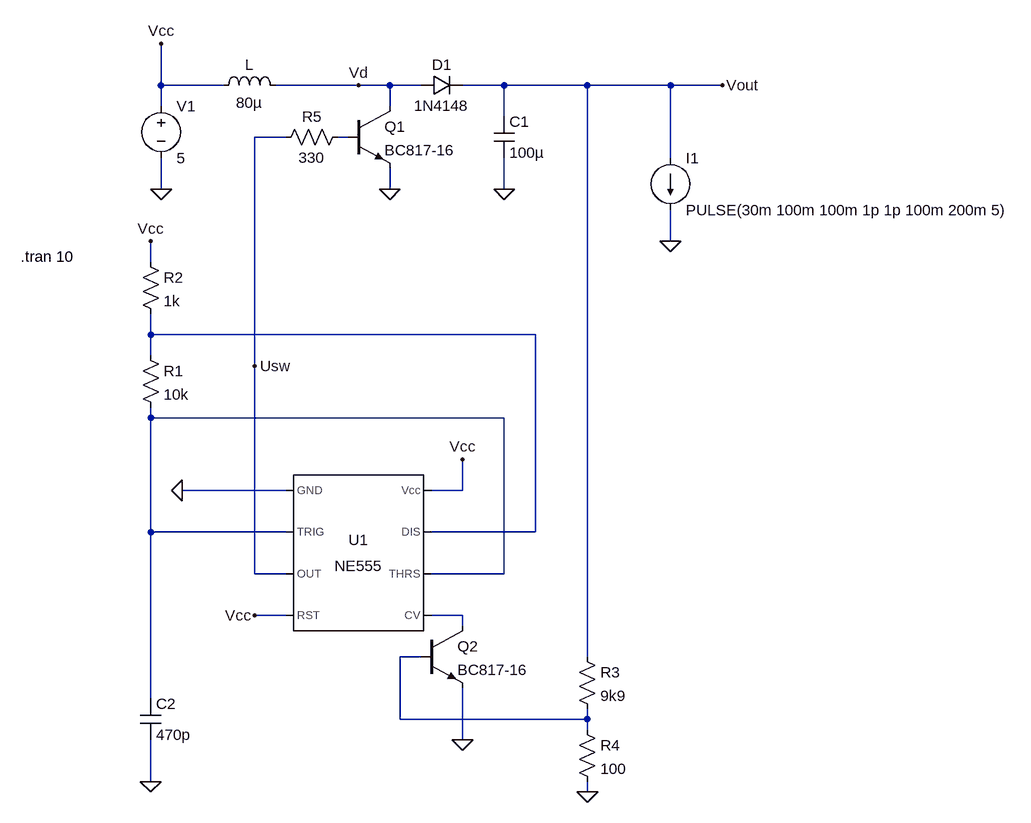
[diagram p0: schematic 555_boost2.asc]
555_boost2.asc, the LTspice schematic file:
Version 4
SHEET 1 1404 980
WIRE 64 -128 64 -192
WIRE 160 -128 64 -128
WIRE 368 -128 240 -128
WIRE 416 -128 368 -128
WIRE 464 -128 416 -128
WIRE 592 -128 528 -128
WIRE 720 -128 592 -128
WIRE 848 -128 720 -128
WIRE 928 -128 848 -128
WIRE 64 -96 64 -128
WIRE 416 -96 416 -128
WIRE 592 -80 592 -128
WIRE 256 -48 208 -48
WIRE 352 -48 336 -48
WIRE 848 -16 848 -128
WIRE 64 32 64 -16
WIRE 416 32 416 0
WIRE 592 32 592 -16
WIRE 848 112 848 64
WIRE 48 144 48 112
WIRE 48 256 48 224
WIRE 640 256 48 256
WIRE 48 288 48 256
WIRE 208 304 208 -48
WIRE 48 384 48 368
WIRE 592 384 48 384
WIRE 256 496 96 496
WIRE 528 496 528 448
WIRE 528 496 480 496
WIRE 48 560 48 384
WIRE 256 560 48 560
WIRE 640 560 640 256
WIRE 640 560 480 560
WIRE 208 624 208 304
WIRE 256 624 208 624
WIRE 592 624 592 384
WIRE 592 624 480 624
WIRE 256 688 208 688
WIRE 528 688 480 688
WIRE 528 704 528 688
WIRE 464 752 432 752
WIRE 720 752 720 -128
WIRE 48 816 48 560
WIRE 432 848 432 752
WIRE 720 848 720 832
WIRE 720 848 432 848
WIRE 720 864 720 848
WIRE 528 880 528 800
WIRE 48 944 48 880
WIRE 720 960 720 944
FLAG 592 32 0
FLAG 416 32 0
FLAG 96 496 0
FLAG 64 -192 Vcc
FLAG 64 32 0
FLAG 48 944 0
FLAG 208 688 Vcc
FLAG 528 448 Vcc
FLAG 720 960 0
FLAG 928 -128 Vout
FLAG 848 112 0
FLAG 208 304 Usw
FLAG 368 -128 Vd
FLAG 528 880 0
FLAG 48 112 Vcc
SYMBOL Misc\\NE555 368 592 R0
SYMATTR InstName U1
SYMBOL ind 144 -112 R270
WINDOW 0 32 56 VTop 2
WINDOW 3 5 56 VBottom 2
SYMATTR InstName L
SYMATTR Value 80µ
SYMBOL diode 464 -112 R270
WINDOW 0 32 32 VTop 2
WINDOW 3 0 32 VBottom 2
SYMATTR InstName D1
SYMATTR Value 1N4148
SYMBOL cap 576 -80 R0
SYMATTR InstName C1
SYMATTR Value 100µ
SYMBOL voltage 64 -112 R0
WINDOW 123 0 0 Left 0
WINDOW 39 0 0 Left 0
SYMATTR InstName V1
SYMATTR Value 5
SYMBOL cap 32 816 R0
SYMATTR InstName C2
SYMATTR Value 470p
SYMBOL res 704 736 R0
SYMATTR InstName R3
SYMATTR Value 9k9
SYMBOL res 704 848 R0
SYMATTR InstName R4
SYMATTR Value 100
SYMBOL npn 464 704 R0
SYMATTR InstName Q2
SYMATTR Value BC817-16
SYMBOL current 848 -16 R0
WINDOW 123 0 0 Left 0
WINDOW 39 0 0 Left 0
SYMATTR InstName I1
SYMATTR Value PULSE(30m 100m 100m 1p 1p 100m 200m 5)
SYMBOL res 352 -64 R90
WINDOW 0 0 56 VBottom 2
WINDOW 3 32 56 VTop 2
SYMATTR InstName R5
SYMATTR Value 330
SYMBOL npn 352 -96 R0
SYMATTR InstName Q1
SYMATTR Value BC817-16
SYMBOL res 32 272 R0
SYMATTR InstName R1
SYMATTR Value 10k
SYMBOL res 32 128 R0
SYMATTR InstName R2
SYMATTR Value 1k
TEXT -152 136 Left 2 !.tran 10

The netlist it stands for:
* 555_boost2.asc
XU1 0 N003 Usw Vcc N004 N003 N002 Vcc NE555  ; pins GND TRIG OUT RST CV THRS DIS Vcc
L Vcc Vd 80µ
D1 Vd Vout 1N4148
C1 Vout 0 100µ
V1 Vcc 0 5
C2 N003 0 470p
R3 Vout N005 9k9
R4 N005 0 100
Q2 N004 N005 0 0 BC817-16
I1 Vout 0 PULSE(30m 100m 100m 1p 1p 100m 200m 5)
R5 N001 Usw 330
Q1 Vd N001 0 0 BC817-16
R1 N002 N003 10k
R2 Vcc N002 1k
.model D D
.lib standard.dio
.model NPN NPN
.model PNP PNP
.lib standard.bjt
.tran 10
.lib NE555.sub
.backanno
.end